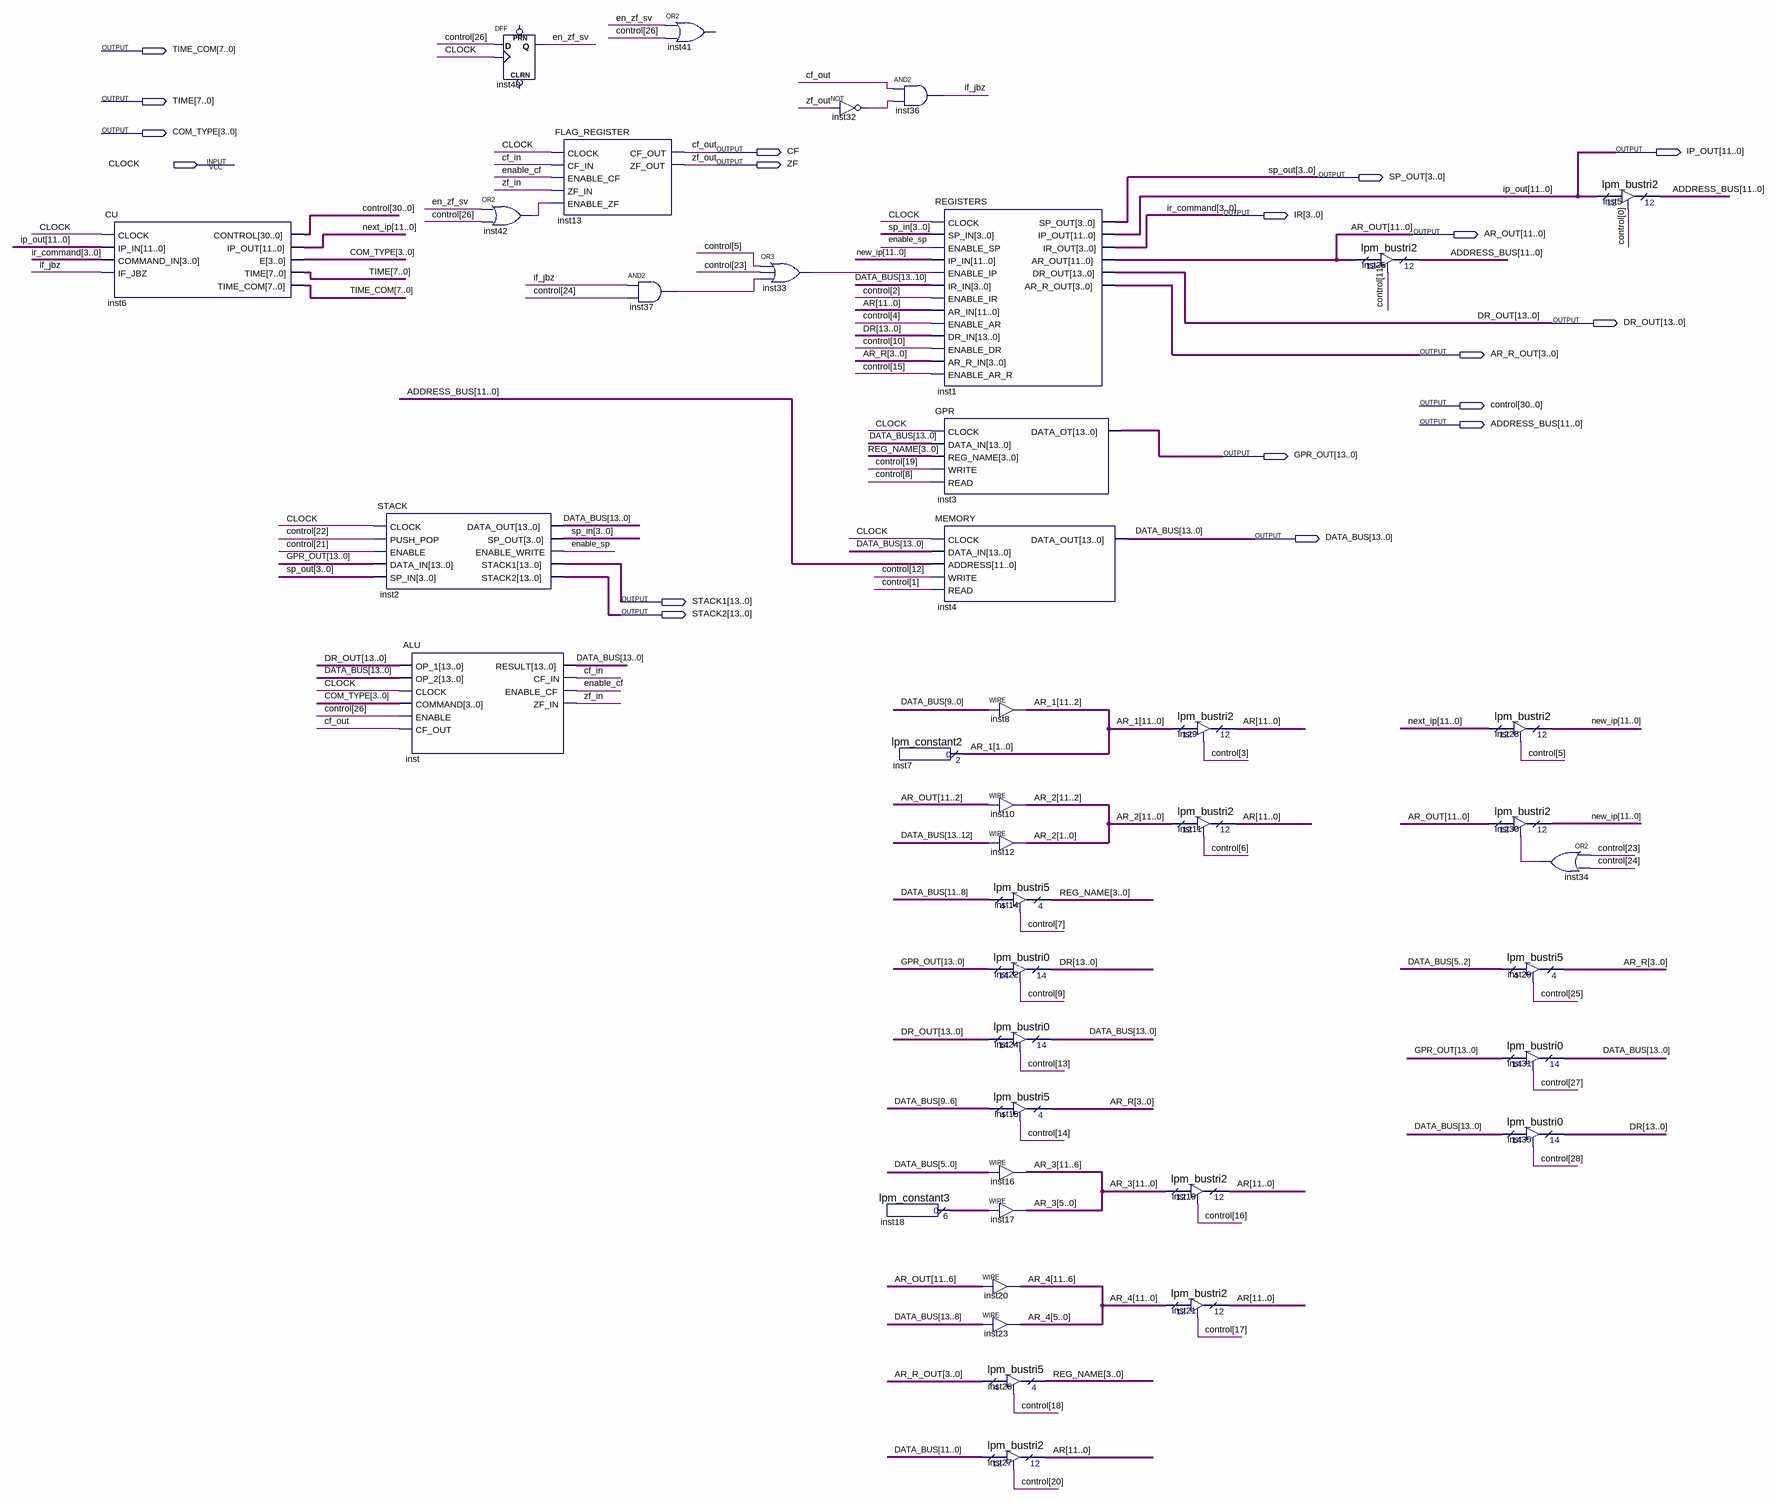
[diagram p0: schematic sheet]
// Quartus schematic KOMPIC.bdf as structural Verilog: 41 symbols, 18 pins
module KOMPIC (
  input  CLOCK,
  output [7:0] TIME_COM,
  output [7:0] TIME,
  output [3:0] COM_TYPE,
  output CF,
  output [11:0] IP_OUT,
  output ZF,
  output [3:0] SP_OUT,
  output [3:0] IR,
  output [11:0] AR_OUT,
  output [13:0] DR_OUT,
  output [3:0] AR_R_OUT,
  output [30:0] control,
  output [11:0] ADDRESS_BUS,
  output [13:0] GPR_OUT,
  output [13:0] DATA_BUS,
  output [13:0] STACK1,
  output [13:0] STACK2
);

  wire cf_in, en_zf_sv, enable_cf, enable_sp, if_jbz, inst32_out, inst33_out, inst34_out, inst37_out,
       inst42_out, zf_in;
  wire [3:0] AR_R, REG_NAME, sp_in;
  wire [5:0] inst18_result;
  wire [11:0] AR, AR_1, AR_2, AR_3, AR_4, new_ip, next_ip;
  wire [13:0] DR;

  CU inst6 (
    .CLOCK(CLOCK), .IP_IN(IP_OUT), .COMMAND_IN(IR), .IF_JBZ(if_jbz), .CONTROL(control), .IP_OUT(next_ip),
    .E(COM_TYPE), .TIME(TIME), .TIME_COM(TIME_COM));
  STACK inst2 (
    .CLOCK(CLOCK), .PUSH_POP(control[22]), .ENABLE(control[21]), .DATA_IN(GPR_OUT), .SP_IN(SP_OUT),
    .DATA_OUT(DATA_BUS), .SP_OUT(sp_in), .ENABLE_WRITE(enable_sp), .STACK1(STACK1), .STACK2(STACK2));
  ALU inst (
    .OP_1(DR_OUT), .OP_2(DATA_BUS), .CLOCK(CLOCK), .COMMAND(COM_TYPE), .ENABLE(control[26]), .CF_OUT(CF),
    .RESULT(DATA_BUS), .CF_IN(cf_in), .ENABLE_CF(enable_cf), .ZF_IN(zf_in));
  DFF inst40 (.CLK(CLOCK), .D(control[26]), .Q(en_zf_sv));  // open: CLRN, PRN
  or inst42 (inst42_out, en_zf_sv, control[26]);
  FLAG_REGISTER inst13 (
    .CLOCK(CLOCK), .CF_IN(cf_in), .ENABLE_CF(enable_cf), .ZF_IN(zf_in), .ENABLE_ZF(inst42_out), .CF_OUT(CF),
    .ZF_OUT(ZF));
  and inst37 (inst37_out, if_jbz, control[24]);
  // OR2 inst41 has open pins: IN1=en_zf_sv, IN2=control[26], OUT=open
  or inst33 (inst33_out, control[5], control[23], inst37_out);
  not inst32 (inst32_out, ZF);
  and inst36 (if_jbz, CF, inst32_out);
  lpm_constant2 inst7 (.result(AR_1[1:0]));
  lpm_constant3 inst18 (.result(inst18_result));
  REGISTERS inst1 (
    .CLOCK(CLOCK), .SP_IN(sp_in), .ENABLE_SP(enable_sp), .IP_IN(new_ip), .ENABLE_IP(inst33_out),
    .IR_IN(DATA_BUS[13:10]), .ENABLE_IR(control[2]), .AR_IN(AR), .ENABLE_AR(control[4]), .DR_IN(DR),
    .ENABLE_DR(control[10]), .AR_R_IN(AR_R), .ENABLE_AR_R(control[15]), .SP_OUT(SP_OUT), .IP_OUT(IP_OUT),
    .IR_OUT(IR), .AR_OUT(AR_OUT), .DR_OUT(DR_OUT), .AR_R_OUT(AR_R_OUT));
  GPR inst3 (
    .CLOCK(CLOCK), .DATA_IN(DATA_BUS), .REG_NAME(REG_NAME), .WRITE(control[19]), .READ(control[8]),
    .DATA_OT(GPR_OUT));
  MEMORY inst4 (
    .CLOCK(CLOCK), .DATA_IN(DATA_BUS), .ADDRESS(ADDRESS_BUS), .WRITE(control[12]), .READ(control[1]),
    .DATA_OUT(DATA_BUS));
  assign AR_1[11:2] = DATA_BUS[9:0];  // WIRE inst8
  assign AR_2[11:2] = AR_OUT[11:2];  // WIRE inst10
  assign AR_2[1:0] = DATA_BUS[13:12];  // WIRE inst12
  lpm_bustri5 inst14 (.enabledt(control[7]), .data(DATA_BUS[11:8]), .tridata(REG_NAME));
  lpm_bustri0 inst22 (.enabledt(control[9]), .data(GPR_OUT), .tridata(DR));
  lpm_bustri0 inst24 (.enabledt(control[13]), .data(DR_OUT), .tridata(DATA_BUS));
  lpm_bustri5 inst15 (.enabledt(control[14]), .data(DATA_BUS[9:6]), .tridata(AR_R));
  assign AR_3[11:6] = DATA_BUS[5:0];  // WIRE inst16
  assign AR_3[5:0] = inst18_result;  // WIRE inst17
  assign AR_4[11:6] = AR_OUT[11:6];  // WIRE inst20
  assign AR_4[5:0] = DATA_BUS[13:8];  // WIRE inst23
  lpm_bustri5 inst26 (.enabledt(control[18]), .data(AR_R_OUT), .tridata(REG_NAME));
  lpm_bustri2 inst27 (.enabledt(control[20]), .data(DATA_BUS[11:0]), .tridata(AR));
  lpm_bustri2 inst9 (.enabledt(control[3]), .data(AR_1), .tridata(AR));
  lpm_bustri2 inst11 (.enabledt(control[6]), .data(AR_2), .tridata(AR));
  lpm_bustri2 inst19 (.enabledt(control[16]), .data(AR_3), .tridata(AR));
  lpm_bustri2 inst21 (.enabledt(control[17]), .data(AR_4), .tridata(AR));
  lpm_bustri2 inst25 (.enabledt(control[11]), .data(AR_OUT), .tridata(ADDRESS_BUS));
  lpm_bustri2 inst28 (.enabledt(control[5]), .data(next_ip), .tridata(new_ip));
  lpm_bustri2 inst30 (.enabledt(inst34_out), .data(AR_OUT), .tridata(new_ip));
  lpm_bustri5 inst29 (.enabledt(control[25]), .data(DATA_BUS[5:2]), .tridata(AR_R));
  lpm_bustri0 inst31 (.enabledt(control[27]), .data(GPR_OUT), .tridata(DATA_BUS));
  lpm_bustri0 inst35 (.enabledt(control[28]), .data(DATA_BUS), .tridata(DR));
  or inst34 (inst34_out, control[23], control[24]);
  lpm_bustri2 inst5 (.enabledt(control[0]), .data(IP_OUT), .tridata(ADDRESS_BUS));

  // Other names for the same wires on the sheet: cf_out = CF; ir_command[3:0] = IR; zf_out = ZF
endmodule
